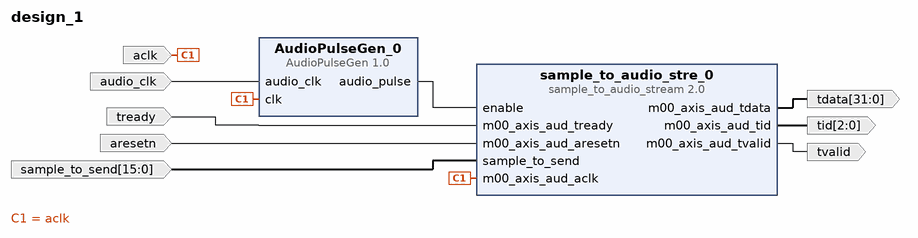
[diagram p0: block diagram of the top level]
# Vivado block design design_1, xc7a200tsbg484-1, Vivado 2018.3.1
create_bd_design design_1

create_bd_port -dir O -from 2 -to 0 tid
create_bd_port -dir O -from 31 -to 0 tdata
create_bd_port -dir O tvalid
create_bd_port -dir I tready
create_bd_port -dir I -type clk aclk
create_bd_port -dir I -type rst aresetn
create_bd_port -dir I -type clk audio_clk
create_bd_port -dir I -from 15 -to 0 sample_to_send

create_bd_cell -type ip -vlnv utoronto.ca:user:sample_to_audio_stream:2.0 sample_to_audio_stre_0
create_bd_cell -type ip -vlnv utoronto.ca:user:AudioPulseGen:1.0 AudioPulseGen_0

# ---- connections ----

connect_bd_net [get_bd_pins sample_to_audio_stre_0/m00_axis_aud_tid] [get_bd_ports tid]
connect_bd_net [get_bd_pins sample_to_audio_stre_0/m00_axis_aud_tdata] [get_bd_ports tdata]
connect_bd_net [get_bd_pins sample_to_audio_stre_0/m00_axis_aud_tvalid] [get_bd_ports tvalid]
connect_bd_net -net m00_axis_aud_tready_0_1 [get_bd_ports tready] [get_bd_pins sample_to_audio_stre_0/m00_axis_aud_tready]
connect_bd_net -net m00_axis_aud_aclk_0_1 [get_bd_ports aclk] [get_bd_pins sample_to_audio_stre_0/m00_axis_aud_aclk] [get_bd_pins AudioPulseGen_0/clk]
connect_bd_net -net m00_axis_aud_aresetn_0_1 [get_bd_ports aresetn] [get_bd_pins sample_to_audio_stre_0/m00_axis_aud_aresetn]
connect_bd_net -net audio_clk_0_1 [get_bd_ports audio_clk] [get_bd_pins AudioPulseGen_0/audio_clk]
connect_bd_net -net sample_to_send_0_1 [get_bd_ports sample_to_send] [get_bd_pins sample_to_audio_stre_0/sample_to_send]
connect_bd_net [get_bd_pins AudioPulseGen_0/audio_pulse] [get_bd_pins sample_to_audio_stre_0/enable]

validate_bd_design
save_bd_design
